# Altium schematic sheet USB.SchDoc: Mini Editor Keyboard
size A3; DrawnBy: Roman Sklyar; Organization: S-LAB; Address1: Russian Federation; Address2: Sergiev Posad; DocumentNumber: 4; Revision: v1.0; SheetNumber: 4; SheetTotal: 6
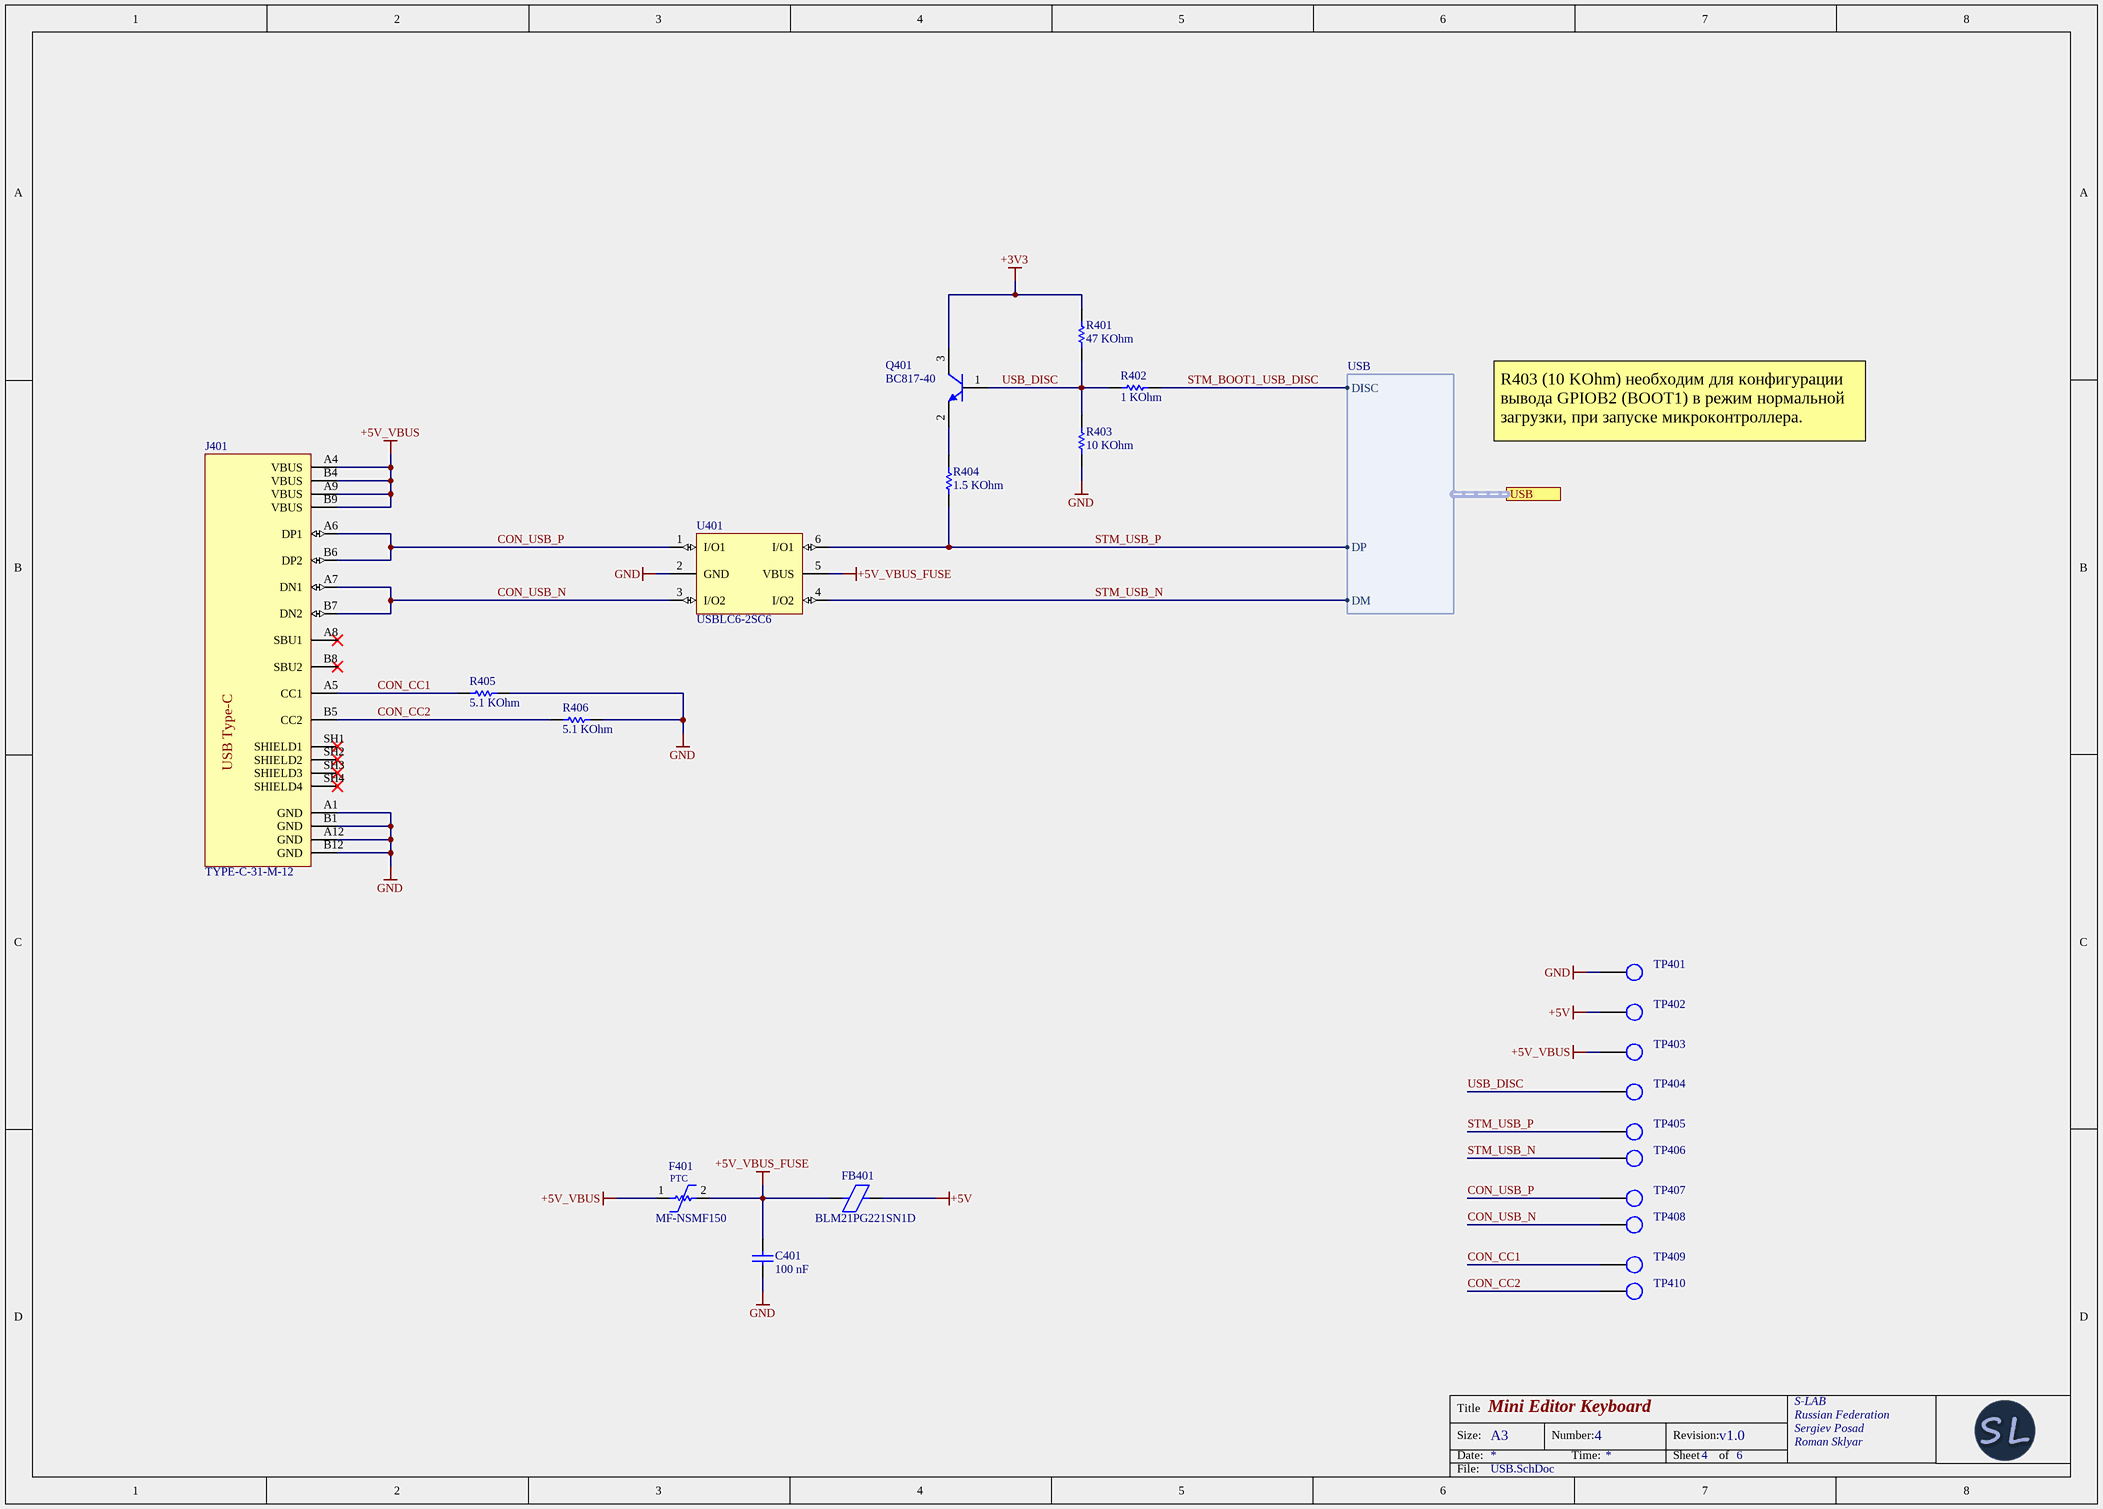
[diagram p0: USB.SchDoc]

## Parts
C401  Capacitance: 100 nF  [CAPC0603]  (hidden comment: CAP-100N)
F401  MF-NSMF150  [PTC1206-BOURNS]
FB401  BLM21PG221SN1D  [INDC-0805-2012X10]
J401  TYPE-C-31-M-12  [TYPE-C-31-M-12]
Q401  BC817-40  [SOT23-3-AnBon]
R401  Resistance: 47 KOhm  [RES0603]  (hidden comment: RES-47K)
R402  Resistance: 1 KOhm  [RES0603]  (hidden comment: RES-1K)
R403  Resistance: 10 KOhm  [RES0603]  (hidden comment: RES-10K)
R404  Resistance: 1.5 KOhm  [RES0603]  (hidden comment: RES-1K5)
R405  Resistance: 5.1 KOhm  [RES0603]  (hidden comment: RES-5K1)
R406  Resistance: 5.1 KOhm  [RES0603]  (hidden comment: RES-5K1)
TP401  (no value)  [TP_C-0.5mm]  (no BOM)
TP402  (no value)  [TP_C-0.5mm]  (no BOM)
TP403  (no value)  [TP_C-0.5mm]  (no BOM)
TP404  (no value)  [TP_C-0.5mm]  (no BOM)
TP405  (no value)  [TP_C-0.5mm]  (no BOM)
TP406  (no value)  [TP_C-0.5mm]  (no BOM)
TP407  (no value)  [TP_C-0.5mm]  (no BOM)
TP408  (no value)  [TP_C-0.5mm]  (no BOM)
TP409  (no value)  [TP_C-0.5mm]  (no BOM)
TP410  (no value)  [TP_C-0.5mm]  (no BOM)
U401  USBLC6-2SC6  [SOT23-6L-STM]

## Ports
USB (harness USB)

## Harnesses
USB: DP, DM, DISC

## Nets
+3V3: Q401.3(C) R401.2
+5V: FB401.2 TP402.1
+5V_VBUS: F401.1 J401.A4(VBUS) J401.A9(VBUS) J401.B4(VBUS) J401.B9(VBUS) TP403.1
+5V_VBUS_FUSE: C401.2 F401.2 FB401.1 U401.5(VBUS)
GND: C401.1 J401.A1(GND) J401.A12(GND) J401.B1(GND) J401.B12(GND) R403.1 R405.1 R406.1 TP401.1 U401.2(GND)
CON_CC1: J401.A5(CC1) R405.2 TP409.1
CON_CC2: J401.B5(CC2) R406.2 TP410.1
CON_USB_N: J401.A7(DN1) J401.B7(DN2) TP408.1 U401.3(I/O2)
CON_USB_P: J401.A6(DP1) J401.B6(DP2) TP407.1 U401.1(I/O1)
STM_BOOT1_USB_DISC: R402.2 ; port USB.DISC
STM_USB_N: TP406.1 U401.4(I/O2) ; port USB.DM
STM_USB_P: R404.2 TP405.1 U401.6(I/O1) ; port USB.DP
USB_DISC: Q401.1(B) R401.1 R402.1 R403.2 TP404.1
NetQ401_2: Q401.2(E) R404.1

Not connected (* = marked no-connect by the designer): J401 A8(SBU1)* B8(SBU2)* SH1(SHIELD1)* SH2(SHIELD2)* SH3(SHIELD3)* SH4(SHIELD4)*

## Notes on the sheet
- R403 (10 KOhm) необходим для конфигурации вывода GPIOB2 (BOOT1) в режим нормальной загрузки, при запуске микроконтроллера.
- Title
- Size:
- Date:
- A3
- Number:
- Time:
- Revision:
- Sheet
- of
- File:
- (in symbol MF-NSMF150) PTC
- (in symbol TYPE-C-31-M-12) USB Type-C

## Library data of the parts
C401 = CAP-100N: Chip Capacitor, 100 nF, +/- 5%; Voltage Rating: 50 V; Mount: Surface Mount; Tolerance: 5 %; Type: Capacitor
F401 = MF-NSMF150: PTC Resettable Fuses 6V 1.5A; Type: Fuse; Mount: Surface Mount; PartNumber: MF-NSMF150
FB401 = BLM21PG221SN1D: 220Ω @ 100MHz 2A 45mΩ 0805 Ferrite Beads; Impedance: 220 Ohm; Mount: Surface Mount; Type: Ferrite Bead; DC Current: 2 A; PartNumber: BLM21PG221SN1D
J401 = TYPE-C-31-M-12: USB - Type C Female 16 8.94*7.3mm USB Connectors; Type: Connector; Mount: Surface Mount; PartNumber: TYPE-C-31-M-12
Q401 = BC817-40: NPN 500mA 45V 300mW SOT-23, hFE 250-600; Type: Transistor; Package: SOT23-3; Mount: Surface Mount; PartNumber: BC817-40
R401 = RES-47K: Chip Resistor, 47 KOhm, +/- 1%; Voltage Rating: 50 V; Mount: Surface Mount; Tolerance: 1 %; Type: Resistor
R402 = RES-1K: Chip Resistor, 1 KOhm, +/- 1%; Voltage Rating: 50 V; Mount: Surface Mount; Tolerance: 1 %; Type: Resistor
R403 = RES-10K: Chip Resistor, 10 KOhm, +/- 1%; Voltage Rating: 50 V; Mount: Surface Mount; Tolerance: 1 %; Type: Resistor
R404 = RES-1K5: Chip Resistor, 1.5 KOhm, +/- 1%; Voltage Rating: 50 V; Mount: Surface Mount; Tolerance: 1 %; Type: Resistor
R405 R406 = RES-5K1: Chip Resistor, 5.1 KOhm, +/- 1%; Voltage Rating: 50 V; Mount: Surface Mount; Tolerance: 1 %; Type: Resistor
TP401-TP410 = TestPad
U401 = USBLC6-2SC6: Very low capacitance ESD protection  3.5 pF max; ESD: 25 kV; Mount: Surface Mount; Type: TVS Diode; PartNumber: USBLC6-2SC6